# Altium schematic sheet Digital Port A Default State DIP.SchDoc: PORT A Default State Selection Switch
size A4
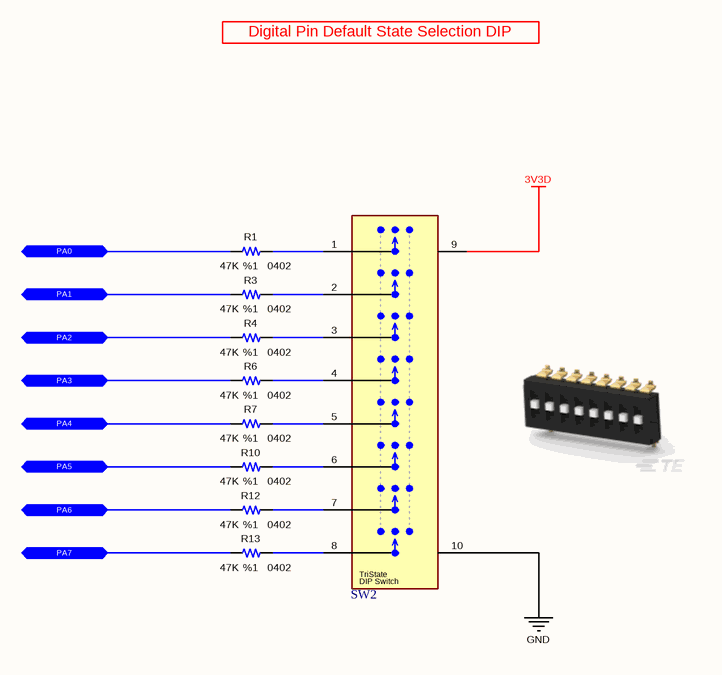
[diagram p0: Digital Port A Default State DIP.SchDoc]

## Parts
R1  value 47K  Tolerance: %1  Case: 0402  [RESISTOR_0402]  (hidden comment: Thick Film Resistor)
R3  value 47K  Tolerance: %1  Case: 0402  [RESISTOR_0402]  (hidden comment: Thick Film Resistor)
R4  value 47K  Tolerance: %1  Case: 0402  [RESISTOR_0402]  (hidden comment: Thick Film Resistor)
R6  value 47K  Tolerance: %1  Case: 0402  [RESISTOR_0402]  (hidden comment: Thick Film Resistor)
R7  value 47K  Tolerance: %1  Case: 0402  [RESISTOR_0402]  (hidden comment: Thick Film Resistor)
R10  value 47K  Tolerance: %1  Case: 0402  [RESISTOR_0402]  (hidden comment: Thick Film Resistor)
R12  value 47K  Tolerance: %1  Case: 0402  [RESISTOR_0402]  (hidden comment: Thick Film Resistor)
R13  value 47K  Tolerance: %1  Case: 0402  [RESISTOR_0402]  (hidden comment: Thick Film Resistor)
SW2  DIP Switches/SIP Switches  [TDS08SGNNTR04]  (value not drawn)

## Ports
PA0 (bidir), PA1 (bidir), PA2 (bidir), PA3 (bidir), PA4 (bidir), PA5 (bidir), PA6 (bidir), PA7 (bidir)

## Nets
3V3D: SW2.9(VCC)
GND: SW2.10(GND)
PA0: R1.2 ; port PA0
PA1: R3.2 ; port PA1
PA2: R4.2 ; port PA2
PA3: R6.2 ; port PA3
PA4: R7.2 ; port PA4
PA5: R10.2 ; port PA5
PA6: R12.2 ; port PA6
PA7: R13.2 ; port PA7
NetR1_1: R1.1 SW2.1
NetR3_1: R3.1 SW2.2
NetR4_1: R4.1 SW2.3
NetR6_1: R6.1 SW2.4
NetR7_1: R7.1 SW2.5
NetR10_1: R10.1 SW2.6
NetR12_1: R12.1 SW2.7
NetR13_1: R13.1 SW2.8

## Notes on the sheet
- Digital Pin Default State Selection DIP
- Title
- Size:
- Date:
- A4
- Number:
- Time:
- Revision:
- Sheet
- of
- File:
- (in symbol Switch - DIP Switch (8 Pole TriState)) TriState; DIP Switch

## Library data of the parts
R1 R3 R4 R6 R7 R10 R12 R13 = Resistor - 47K: Thick Film Resistors - SMD 1/16 W 47 Kohms 1%; Manufacturer Name: Vishay; Manufacturer Part Number: CRCW040247K0FKED; Height: 0.4mm; Mouser Part Number: 71-CRCW0402-47K-E3; ComponentLink1Description: DataSheet; ComponentLink1URL: https://www.mouser.com.tr/datasheet/2/427/dcrcwe3-1762152.pdf; ComponentLink2Description: Mouser; ComponentLink2URL: https://www.mouser.com.tr/ProductDetail/Vishay-Dale/CRCW040247K0FKED?qs=sGAEpiMZZMu61qfTUdNhG2DpbjADlD3GL%252B3h1elTxqU%3D; Supplier 1: Mouser; Supplier 2: Digi-Key; Supplier Part Number 1: 71-CRCW040247K0FKEDH; Supplier Part Number 2: 541-47.0KYCT-ND
SW2 = Switch - DIP Switch (8 Pole TriState): DIP Switches/SIP Switches TRI-STATE DIP 8P G RAISED T&R; Manufacturer Name: TE Connectivity; Manufacturer Part Number: TDS08SGNNTR04; Mouser Part Number: 506-TDS08SGNNTR04; ComponentLink1Description: DataSheet; ComponentLink1URL: https://www.mouser.com.tr/datasheet/2/418/4/NG_DS_1-1773931-8_ALCOSWITCH_DIP_TDS_0917-1221113.pdf; ComponentLink2Description: Mouser; ComponentLink2URL: https://www.mouser.com.tr/ProductDetail/TE-Connectivity-Alcoswitch/TDS08SGNNTR04/?qs=wd5RIQLrsJiLOOX2pWoyQw==